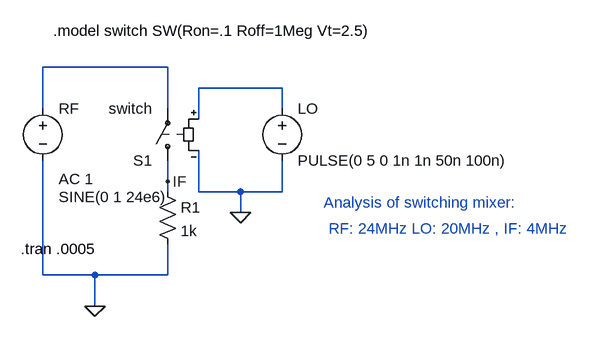
[diagram p0: schematic Mixer_RF_Switch.asc]
Mixer_RF_Switch.asc, the LTspice schematic file:
Version 4
SHEET 1 880 680
WIRE 160 32 -32 32
WIRE 336 64 208 64
WIRE -32 96 -32 32
WIRE 160 96 160 32
WIRE 336 96 336 64
WIRE 208 112 208 64
WIRE 160 208 160 176
WIRE 160 224 160 208
WIRE 208 224 208 160
WIRE 272 224 208 224
WIRE 336 224 336 176
WIRE 336 224 272 224
WIRE 272 256 272 224
WIRE -32 352 -32 176
WIRE 48 352 -32 352
WIRE 160 352 160 304
WIRE 160 352 48 352
WIRE 48 400 48 352
FLAG 272 256 0
FLAG 48 400 0
FLAG 160 208 IF
SYMBOL sw 160 192 R180
SYMATTR InstName S1
SYMATTR Value switch
SYMBOL voltage 336 80 R0
WINDOW 123 0 0 Left 0
WINDOW 39 0 0 Left 0
SYMATTR InstName LO
SYMATTR Value PULSE(0 5 0 1n 1n 50n 100n)
SYMBOL voltage -32 80 R0
WINDOW 3 24 152 Left 2
WINDOW 123 24 124 Left 2
WINDOW 39 0 0 Left 0
SYMATTR InstName RF
SYMATTR Value SINE(0 1 24e6)
SYMATTR Value2 AC 1
SYMBOL res 144 208 R0
SYMATTR InstName R1
SYMATTR Value 1k
TEXT -66 312 Left 2 !.tran .0005
TEXT -16 -24 Left 2 !.model switch SW(Ron=.1 Roff=1Meg Vt=2.5)
TEXT 400 240 Left 2 ;Analysis of switching mixer:
TEXT 408 280 Left 2 ;RF: 24MHz LO: 20MHz , IF: 4MHz

The netlist it stands for:
* Mixer_RF_Switch.asc
S1 IF N001 N002 0 switch
V§LO N002 0 PULSE(0 5 0 1n 1n 50n 100n)
V§RF N001 0 SINE(0 1 24e6) AC 1
R1 IF 0 1k
.tran .0005
.model switch SW(Ron=.1 Roff=1Meg Vt=2.5)
* Analysis of switching mixer:
* RF: 24MHz LO: 20MHz , IF: 4MHz
.backanno
.end